# Altium schematic sheet rev02_5.SchDoc
size 409 x 282 mm
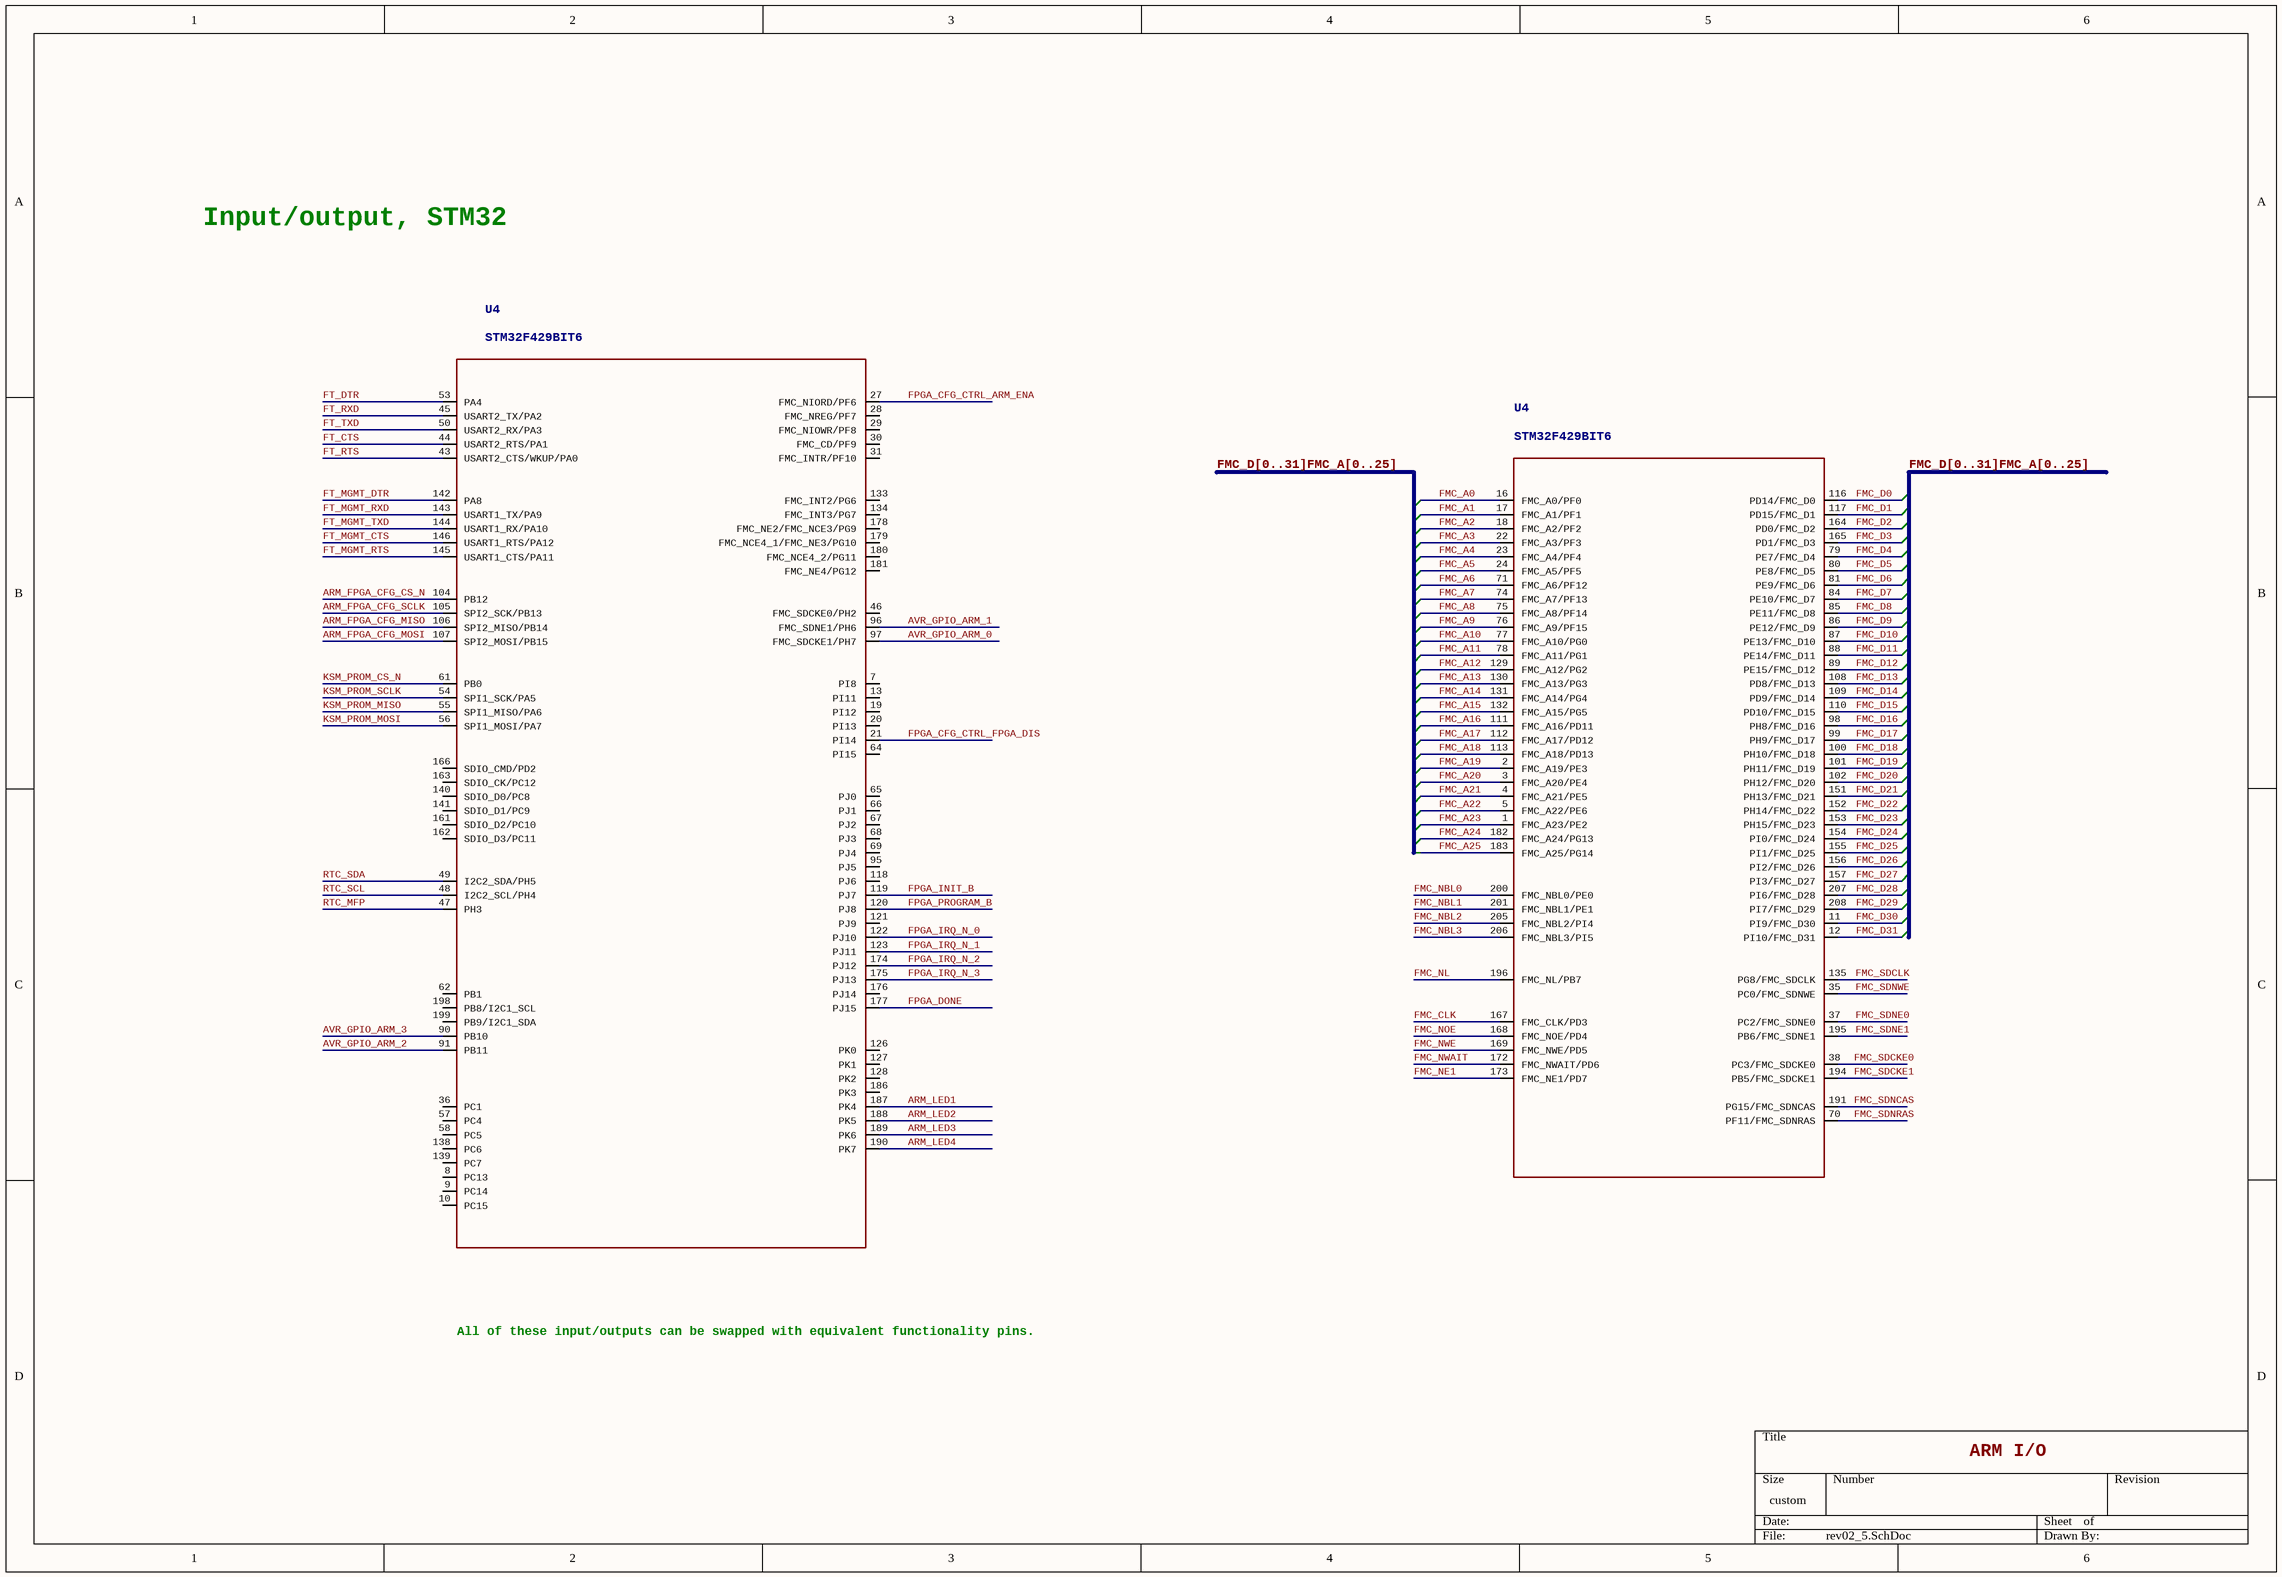
[diagram p0: rev02_5.SchDoc]

## Parts
U4  >NAME: U4  [TSQFP50P3000X3000X160-208N]  (hidden comment: STM32F429BIT6)  (parts A,D of 4)

## Nets
ARM_FPGA_CFG_CS_N: U4.104(PB12)
ARM_FPGA_CFG_MISO: U4.106(SPI2_MISO/PB14)
ARM_FPGA_CFG_MOSI: U4.107(SPI2_MOSI/PB15)
ARM_FPGA_CFG_SCLK: U4.105(SPI2_SCK/PB13)
ARM_LED1: U4.187(PK4)
ARM_LED2: U4.188(PK5)
ARM_LED3: U4.189(PK6)
ARM_LED4: U4.190(PK7)
AVR_GPIO_ARM_0: U4.97(FMC_SDCKE1/PH7)
AVR_GPIO_ARM_1: U4.96(FMC_SDNE1/PH6)
AVR_GPIO_ARM_2: U4.91(PB11)
AVR_GPIO_ARM_3: U4.90(PB10)
FMC_A0: U4.16(FMC_A0/PF0)
FMC_A1: U4.17(FMC_A1/PF1)
FMC_A2: U4.18(FMC_A2/PF2)
FMC_A3: U4.22(FMC_A3/PF3)
FMC_A4: U4.23(FMC_A4/PF4)
FMC_A5: U4.24(FMC_A5/PF5)
FMC_A6: U4.71(FMC_A6/PF12)
FMC_A7: U4.74(FMC_A7/PF13)
FMC_A8: U4.75(FMC_A8/PF14)
FMC_A9: U4.76(FMC_A9/PF15)
FMC_A10: U4.77(FMC_A10/PG0)
FMC_A11: U4.78(FMC_A11/PG1)
FMC_A12: U4.129(FMC_A12/PG2)
FMC_A13: U4.130(FMC_A13/PG3)
FMC_A14: U4.131(FMC_A14/PG4)
FMC_A15: U4.132(FMC_A15/PG5)
FMC_A16: U4.111(FMC_A16/PD11)
FMC_A17: U4.112(FMC_A17/PD12)
FMC_A18: U4.113(FMC_A18/PD13)
FMC_A19: U4.2(FMC_A19/PE3)
FMC_A20: U4.3(FMC_A20/PE4)
FMC_A21: U4.4(FMC_A21/PE5)
FMC_A22: U4.5(FMC_A22/PE6)
FMC_A23: U4.1(FMC_A23/PE2)
FMC_A24: U4.182(FMC_A24/PG13)
FMC_A25: U4.183(FMC_A25/PG14)
FMC_CLK: U4.167(FMC_CLK/PD3)
FMC_D0: U4.116(PD14/FMC_D0)
FMC_D1: U4.117(PD15/FMC_D1)
FMC_D2: U4.164(PD0/FMC_D2)
FMC_D3: U4.165(PD1/FMC_D3)
FMC_D4: U4.79(PE7/FMC_D4)
FMC_D5: U4.80(PE8/FMC_D5)
FMC_D6: U4.81(PE9/FMC_D6)
FMC_D7: U4.84(PE10/FMC_D7)
FMC_D8: U4.85(PE11/FMC_D8)
FMC_D9: U4.86(PE12/FMC_D9)
FMC_D10: U4.87(PE13/FMC_D10)
FMC_D11: U4.88(PE14/FMC_D11)
FMC_D12: U4.89(PE15/FMC_D12)
FMC_D13: U4.108(PD8/FMC_D13)
FMC_D14: U4.109(PD9/FMC_D14)
FMC_D15: U4.110(PD10/FMC_D15)
FMC_D16: U4.98(PH8/FMC_D16)
FMC_D17: U4.99(PH9/FMC_D17)
FMC_D18: U4.100(PH10/FMC_D18)
FMC_D19: U4.101(PH11/FMC_D19)
FMC_D20: U4.102(PH12/FMC_D20)
FMC_D21: U4.151(PH13/FMC_D21)
FMC_D22: U4.152(PH14/FMC_D22)
FMC_D23: U4.153(PH15/FMC_D23)
FMC_D24: U4.154(PI0/FMC_D24)
FMC_D25: U4.155(PI1/FMC_D25)
FMC_D26: U4.156(PI2/FMC_D26)
FMC_D27: U4.157(PI3/FMC_D27)
FMC_D28: U4.207(PI6/FMC_D28)
FMC_D29: U4.208(PI7/FMC_D29)
FMC_D30: U4.11(PI9/FMC_D30)
FMC_D31: U4.12(PI10/FMC_D31)
FMC_NBL0: U4.200(FMC_NBL0/PE0)
FMC_NBL1: U4.201(FMC_NBL1/PE1)
FMC_NBL2: U4.205(FMC_NBL2/PI4)
FMC_NBL3: U4.206(FMC_NBL3/PI5)
FMC_NE1: U4.173(FMC_NE1/PD7)
FMC_NL: U4.196(FMC_NL/PB7)
FMC_NOE: U4.168(FMC_NOE/PD4)
FMC_NWAIT: U4.172(FMC_NWAIT/PD6)
FMC_NWE: U4.169(FMC_NWE/PD5)
FMC_SDCKE0: U4.38(PC3/FMC_SDCKE0)
FMC_SDCKE1: U4.194(PB5/FMC_SDCKE1)
FMC_SDCLK: U4.135(PG8/FMC_SDCLK)
FMC_SDNCAS: U4.191(PG15/FMC_SDNCAS)
FMC_SDNE0: U4.37(PC2/FMC_SDNE0)
FMC_SDNE1: U4.195(PB6/FMC_SDNE1)
FMC_SDNRAS: U4.70(PF11/FMC_SDNRAS)
FMC_SDNWE: U4.35(PC0/FMC_SDNWE)
FPGA_CFG_CTRL_ARM_ENA: U4.27(FMC_NIORD/PF6)
FPGA_CFG_CTRL_FPGA_DIS: U4.21(PI14)
FPGA_DONE: U4.177(PJ15)
FPGA_INIT_B: U4.119(PJ7)
FPGA_IRQ_N_0: U4.122(PJ10)
FPGA_IRQ_N_1: U4.123(PJ11)
FPGA_IRQ_N_2: U4.174(PJ12)
FPGA_IRQ_N_3: U4.175(PJ13)
FPGA_PROGRAM_B: U4.120(PJ8)
FT_CTS: U4.44(USART2_RTS/PA1)
FT_DTR: U4.53(PA4)
FT_MGMT_CTS: U4.146(USART1_RTS/PA12)
FT_MGMT_DTR: U4.142(PA8)
FT_MGMT_RTS: U4.145(USART1_CTS/PA11)
FT_MGMT_RXD: U4.143(USART1_TX/PA9)
FT_MGMT_TXD: U4.144(USART1_RX/PA10)
FT_RTS: U4.43(USART2_CTS/WKUP/PA0)
FT_RXD: U4.45(USART2_TX/PA2)
FT_TXD: U4.50(USART2_RX/PA3)
KSM_PROM_CS_N: U4.61(PB0)
KSM_PROM_MISO: U4.55(SPI1_MISO/PA6)
KSM_PROM_MOSI: U4.56(SPI1_MOSI/PA7)
KSM_PROM_SCLK: U4.54(SPI1_SCK/PA5)
RTC_MFP: U4.47(PH3)
RTC_SCL: U4.48(I2C2_SCL/PH4)
RTC_SDA: U4.49(I2C2_SDA/PH5)

Not connected (* = marked no-connect by the designer): U4 7(PI8) 8(PC13) 9(PC14) 10(PC15) 13(PI11) 19(PI12) 20(PI13) 28(FMC_NREG/PF7) 29(FMC_NIOWR/PF8) 30(FMC_CD/PF9) 31(FMC_INTR/PF10) 36(PC1) 46(FMC_SDCKE0/PH2) 57(PC4) 58(PC5) 62(PB1) 64(PI15) 65(PJ0) 66(PJ1) 67(PJ2) 68(PJ3) 69(PJ4) 95(PJ5) 118(PJ6) 121(PJ9) 126(PK0) 127(PK1) 128(PK2) 133(FMC_INT2/PG6) 134(FMC_INT3/PG7) 138(PC6) 139(PC7) 140(SDIO_D0/PC8) 141(SDIO_D1/PC9) 161(SDIO_D2/PC10) 162(SDIO_D3/PC11) 163(SDIO_CK/PC12) 166(SDIO_CMD/PD2) 176(PJ14) 178(FMC_NE2/FMC_NCE3/PG9) 179(FMC_NCE4_1/FMC_NE3/PG10) 180(FMC_NCE4_2/PG11) 181(FMC_NE4/PG12) 186(PK3) 198(PB8/I2C1_SCL) 199(PB9/I2C1_SDA)

## Buses and harness runs
bus FMC_D[0..31]FMC_A[0..25]

## Notes on the sheet
- Input/output, STM32
- All of these input/outputs can be swapped
  with equivalent functionality pins.
- ARM I/O

## Library data of the parts
U4 = STM32F429BIT6: STM32F429 Cortex-M4 CPU / 180 MHz, 256 KB RAM, 2 MB Flash; OC_FARNELL: 2469581; >VALUE: STM32F429BIT6